# EAGLE design Gnd_iso (EAGLE 7.2.0)
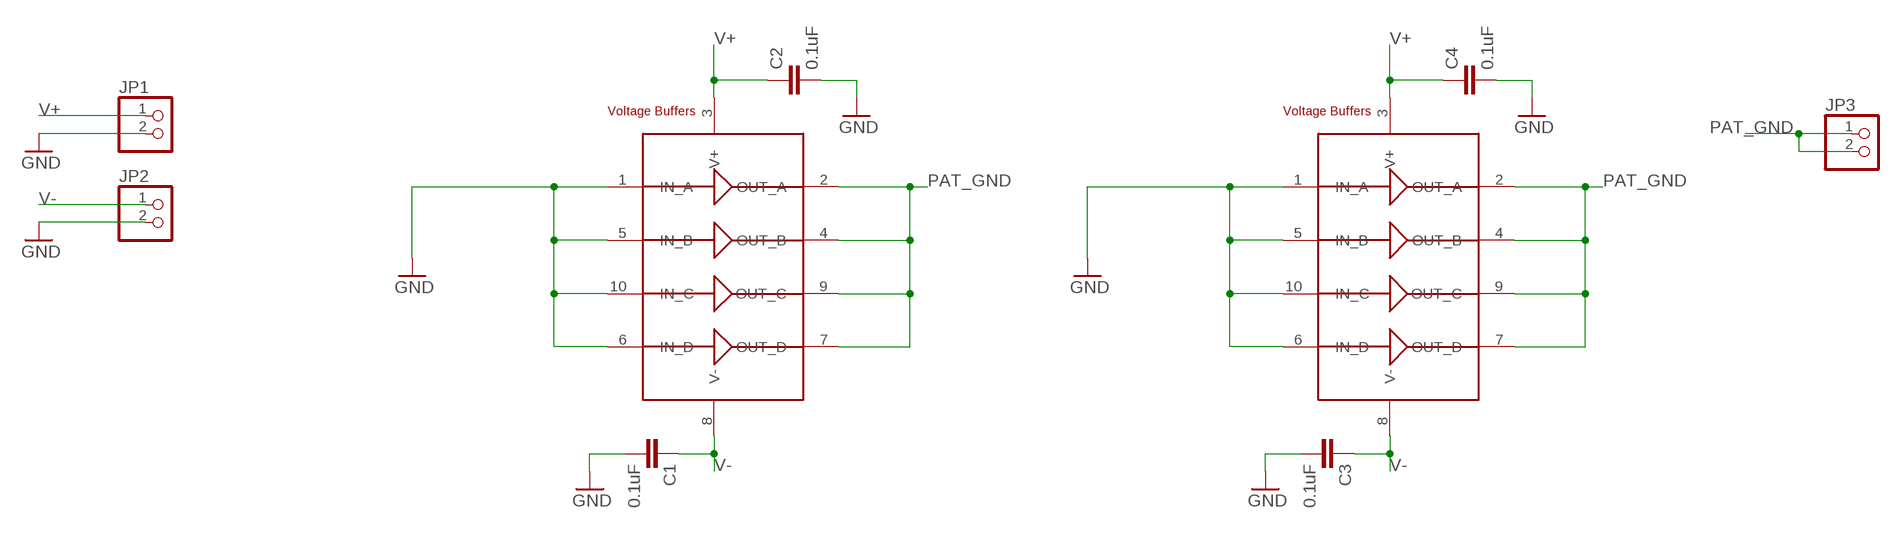
[diagram p0: schematic, sheet 1]

## Parts
C1  0.1uF  C-EUC0805  [C0805]
C2  0.1uF  C-EUC0805  [C0805]
C3  0.1uF  C-EUC0805  [C0805]
C4  0.1uF  C-EUC0805  [C0805]
JP1  PINHD-1X2/90  [1X02/90]
JP2  PINHD-1X2/90  [1X02/90]
JP3  PINHD-1X2/90  [1X02/90]
U1  AD8244  [MSOP10]
U2  AD8244  [MSOP10]

## Nets
GND: C1.2 C2.2 C3.2 C4.2 JP1.2 JP2.2 U1.1(IN_A) U1.5(IN_B) U1.6(IN_D) U1.10(IN_C) U2.1(IN_A) U2.5(IN_B) U2.6(IN_D) U2.10(IN_C)
PAT_GND: JP3.1 JP3.2 U1.2(OUT_A) U1.4(OUT_B) U1.7(OUT_D) U1.9(OUT_C) U2.2(OUT_A) U2.4(OUT_B) U2.7(OUT_D) U2.9(OUT_C)
V+: C2.1 C4.1 JP1.1 U1.3(V+) U2.3(V+)
V-: C1.1 C3.1 JP2.1 U1.8(V-) U2.8(V-)

## Library data of the parts
C1-C4 = resistor:C-EU: CAPACITOR, European symbol
JP1-JP3 = pinhead:PINHD-1X2: PIN HEADER
U1 U2 = AD8244:AD8244

## Board
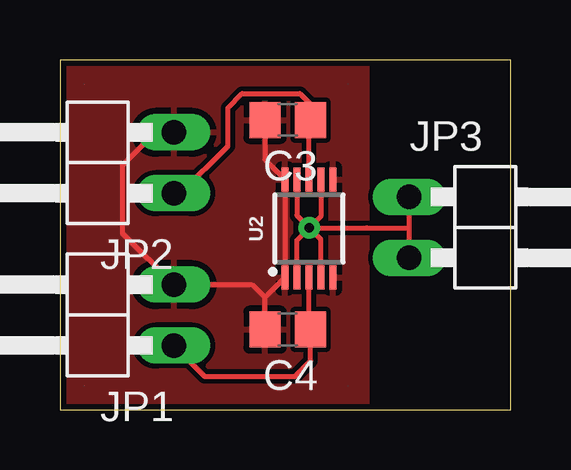
[diagram p1: board, top side]
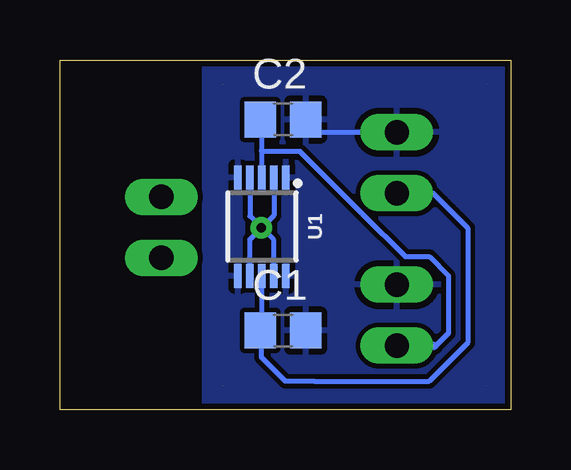
[diagram p2: board, bottom side, seen from below]

Size 18.8 x 14.6 mm. Coordinates in mm from the lower left corner, seen from the top.
Outline: 0,0 18.8,0 18.8,14.6 0,14.6 0,0
Copper layers (1*16): Top 0.035mm / dielectric 1.5mm / Bottom 0.035mm
Design rules "pcbtrain": minimum track width 0.2mm, minimum drill 0.4mm, track to track 0.2mm, track to pad 0.2mm, pad to pad 0.2mm, via to via 0.2mm, smd to smd 0mil, copper to edge 10mil, drill to drill 0.2mm, minimum pad ring 10mil, minimum via ring 10mil, stop-mask expansion 0.125mm, vias tented up to drill 0mil, thermal gap 10mil

### Footprints (pad centres in the part's own frame; a part is rotated, then mirrored left to right if it is on the bottom)
C0805 = smd 1.3 x 1.5: 1 -0.95,0; 2 0.95,0
1X02/90 = drill 1.016 long: 1 -1.27,-3.81; 2 1.27,-3.81
MSOP10 = smd 0.3 x 1: 1 -1,-2.05; 2 -0.5,-2.05; 3 0,-2.05; 4 0.5,-2.05; 5 1,-2.05; 6 1,2.05; 7 0.5,2.05; 8 0,2.05; 9 -0.5,2.05; 10 -1,2.05

### Placement (x,y rotation side)
C1  9.5,3.31 0 bottom
C2  9.5,12.12 0 bottom
C3  9.5,12.1 180 top
C4  9.5,3.36 180 top
JP1  0.94,3.96 90 top
JP2  0.94,10.31 90 top
JP3  18.38,7.62 270 top
U1  10.38,7.65 180 bottom
U2  10.38,7.57 0 top

### Tracks (layer width: path | path; a pad name or v marks a point on that pad's centre or on a via)
GND  (4 unrouted)
  Top 0.2: C3.2 8.55,10.45 U2.10 U2.1 8.63,4.77 8.55,4.69 | 8.55,4.69 C4.2 C1.2 | 8.55,4.69 8.01,5.23 JP1.2 2.6,7.38 2.6,10.2 3.98,11.58 JP2.2
  Bottom 0.2: C2.2 8.01,11.58 JP2.2
  pour Top: 0.2,14.4 12.8,14.4 12.8,0.2 0.2,0.2
  pour Bottom: 0.2,14.4 12.8,14.4 12.8,0.2 0.2,0.2
PAT_GND  (via drill 0.4)
  Top 0.2: JP3.2 14.57,7.6 | 14.57,7.6 JP3.1 | U2.2 9.88,7.08 v10.4,7.6 | U2.4 10.88,7.12 v10.4,7.6 | U2.9 9.88,8.12 v10.4,7.6 | U2.7 10.88,8.08 v10.4,7.6 | v10.4,7.6 12.8,7.6 14.57,7.6
  Bottom 0.2: U1.9 9.88,7.08 v10.4,7.6 | U1.7 10.88,7.12 v10.4,7.6 | U1.2 9.88,8.12 v10.4,7.6 | U1.4 10.88,8.08 v10.4,7.6
V+
  Top 0.2: JP1.1 6.04,1.4 9.8,1.4 10.45,2.05 C4.1 10.38,3.43 U2.3
  Bottom 0.2: C2.1 10.38,12.05 10.4,12.03 10.4,10.8 10.38,10.78 | 3.2,2.6 3.14,2.66 2.6,3.2 2.6,5.6 3.4,6.4 4.4,6.4 6.2,8.2 8.78,10.78 10.38,10.78 | U1.3 10.38,10.4 10.38,10.78
  Bottom 0.254: JP1.1 4.57,2.71 3.2,2.71 3.14,2.66
V-
  Top 0.2: U2.8 10.38,11.63 C3.1 10.4,11.75 10.4,12.8 10,13.2 7.6,13.2 7,12.6 7,11 5.04,9.04 JP2.1
  Bottom 0.2: JP2.1 3.24,9.04 1.8,7.6 1.8,2.8 3.4,1.2 8.2,1.2 9.4,1.2 10.4,2.2 10.4,3.26 C1.1 10.38,3.38 U1.8